# EAGLE design keyring (EAGLE 6.5.0)
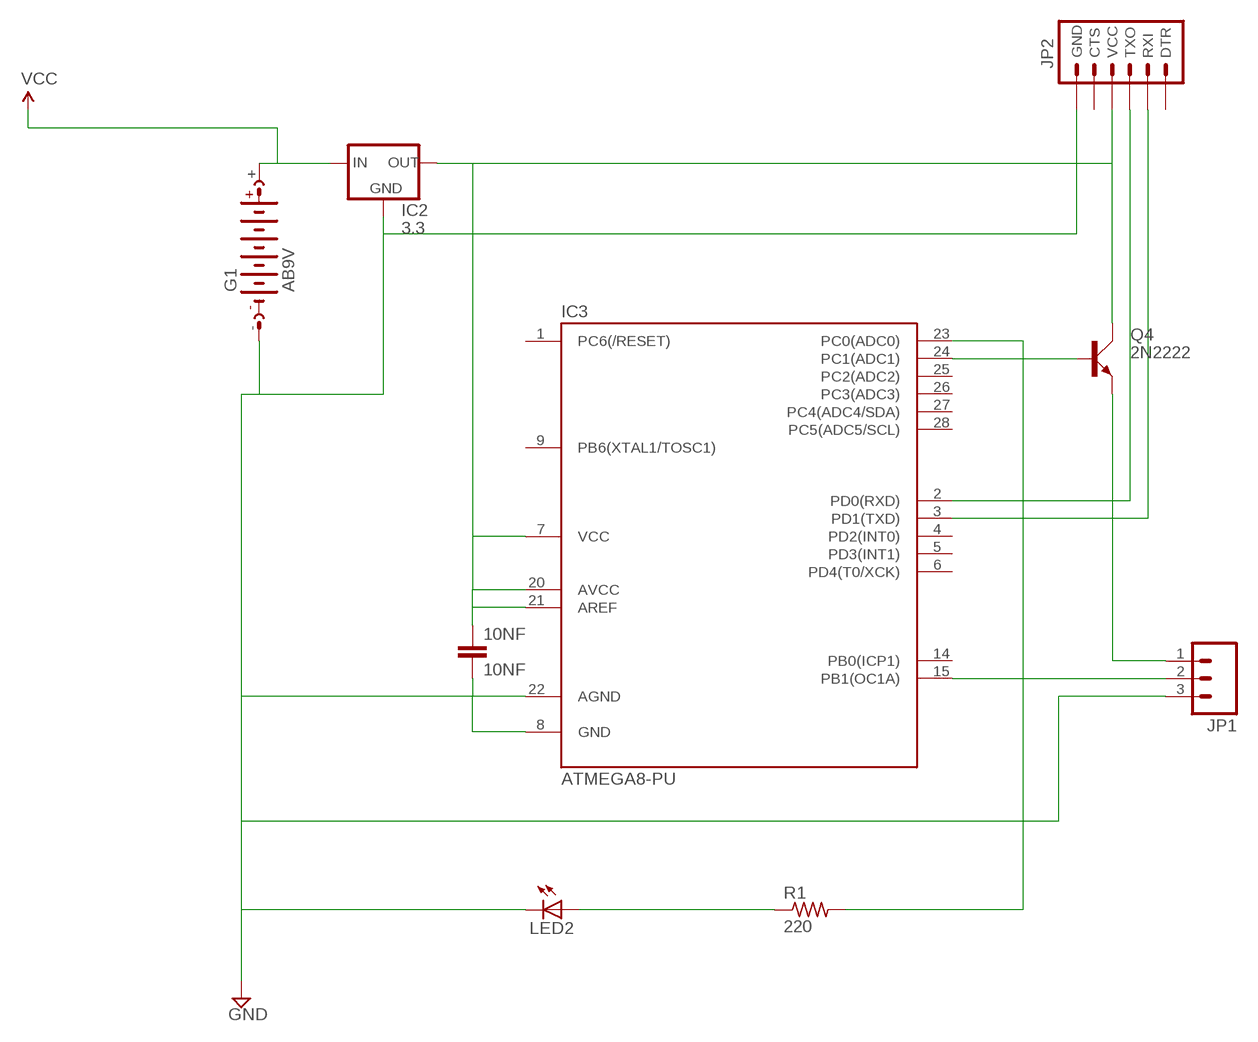
[diagram p0: schematic, sheet 1]

## Parts
10NF  10NF  C2.5/4  [C2.5-4]
G1  AB9V  [AB9V]
IC2  3.3  V_REG_78XXSINK  [TO220-IGO]
IC3  ATMEGA8-PU  [DIL28-3]
JP1  M03LONGPADS  [1X03_LONGPADS]
JP2  ARDUINO_SERIAL_PROGRAMLONGPADS  [1X06_LONGPADS]
LED2  LED3MM  [LED3MM]
Q4  2N2222  [TO18A]
R1  220  R-US_0207/12  [0207/12]

## Nets
N$1: IC3.24(PC1(ADC1)) Q4.B
N$2: IC3.3(PD1(TXD)) JP2.2(RXI)
N$3: IC3.2(PD0(RXD)) JP2.3(TXO)
N$4: JP1.1(OUT) Q4.E
N$5: IC3.23(PC0(ADC0)) R1.2
N$6: IC3.15(PB1(OC1A)) JP1.2(GND)
N$7: LED2.A R1.1
N$8: 10NF.1 IC2.OUT IC3.7(VCC) IC3.20(AVCC) IC3.21(AREF) JP2.4(VCC) Q4.C
N$10: 10NF.2 G1.- IC2.GND IC3.8(GND) IC3.22(AGND) JP1.3(VCC) JP2.6(GND) LED2.K(C) ; supply symbol labelled GND
VCC: G1.+ IC2.IN
Unconnected: IC3.1(PC6(/RESET)) IC3.4(PD2(INT0)) IC3.5(PD3(INT1)) IC3.6(PD4(T0/XCK)) IC3.9(PB6(XTAL1/TOSC1)) IC3.14(PB0(ICP1)) IC3.25(PC2(ADC2)) IC3.26(PC3(ADC3)) IC3.27(PC4(ADC4/SDA)) IC3.28(PC5(ADC5/SCL)) JP2.1(DTR) JP2.5(CTS)

## Library data of the parts
10NF = capacitor-wima:C: CAPACITOR naming: grid - package width
G1 = battery:AB9V: 9-V BATTERY CLIP
IC2 = SparkFun:V_REG_78XX: Voltage Regulator Standard 7805 5V regulator. IGO (Input Ground Output). Spark Fun Electronics SKU : COM-00107
IC3 = atmega8 uden ben:ATMEGA8-PU
JP1 = SparkFun:M03: Header 3 Standard 3-pin 0.1" header. Use with straight break away headers (SKU : PRT-00116), right angle break away headers (PRT-00553), swiss pins (PRT-00743), machine pins (PRT-00117), and female headers (PRT-00115). Molex polarized connector foot print use with SKU : PRT-08232 with associated crimp pins and housings.
JP2 = SparkFun:ARDUINO_SERIAL_PROGRAM
LED2 = led:LED: LED OSRAM: - CHIPLED LG R971, LG N971, LY N971, LG Q971, LY Q971, LO R971, LY R971 LH N974, LH R974 LS Q976, LO Q976, LY Q976 LO Q996 - Hyper CHIPLED LW Q18S LB Q993, LB Q99A, LB R99A - SideLED LS A670, LO A670, LY A670, LG A670, LP A670 LB A673, LV A673, LT A673, LW A673 LH A674 LY A675 LS A676, LA A676, LO A676, LY A676, LW A676 LS A679, LY A679, LG A679 - Hyper Micro SIDELED® LS Y876, LA Y876, LO Y876, LY Y876 LT Y87S - SmartLED LW L88C, LW L88S LB L89C, LB L89S, LG L890 LS L89K, LO L89K, LY L89K LS L896, LA L896, LO L896, LY L896 - TOPLED LS T670, LO T670, LY T670, LG T670, LP T670 LSG T670, LSP T670, LSY T670, LOP T670, LYG T670 LG T671, LOG T671, LSG T671 LB T673, LV T673, LT T673, LW T673 LH T674 LS T676, LA T676, LO T676, LY T676, LB T676, LH T676, LSB T676, LW T676 LB T67C, LV T67C, LT T67C, LS T67K, LO T67K, LY T67K, LW E67C LS E67B, LA E67B, LO E67B, LY E67B, LB E67C, LV E67C, LT E67C LW T67C LS T679, LY T679, LG T679 LS T770, LO T770, LY T770, LG T770, LP T770 LB T773, LV T773, LT T773, LW T773 LH T774 LS E675, LA E675, LY E675, LS T675 LS T776, LA T776, LO T776, LY T776, LB T776 LHGB T686 LT T68C, LB T68C - Hyper Mini TOPLED® LB M676 - Mini TOPLED Santana® LG M470 LS M47K, LO M47K, LY M47K Source: http://www.osram.convergy.de LUXEON: - LUMILED® LXK2-PW12-R00, LXK2-PW12-S00, LXK2-PW14-U00, LXK2-PW14-V00 LXK2-PM12-R00, LXK2-PM12-S00, LXK2-PM14-U00 LXK2-PE12-Q00, LXK2-PE12-R00, LXK2-PE12-S00, LXK2-PE14-T00, LXK2-PE14-U00 LXK2-PB12-K00, LXK2-PB12-L00, LXK2-PB12-M00, LXK2-PB14-N00, LXK2-PB14-P00, LXK2-PB14-Q00 LXK2-PR12-L00, LXK2-PR12-M00, LXK2-PR14-Q00, LXK2-PR14-R00 LXK2-PD12-Q00, LXK2-PD12-R00, LXK2-PD12-S00 LXK2-PH12-R00, LXK2-PH12-S00 LXK2-PL12-P00, LXK2-PL12-Q00, LXK2-PL12-R00 Source: www.luxeon.com KINGBRIGHT: KA-3528ASYC Source: www.kingbright.com
Q4 = transistor-small-signal:2N2222: NPN TRANSISTOR
R1 = resistor:R-US_: RESISTOR, American symbol

## Board
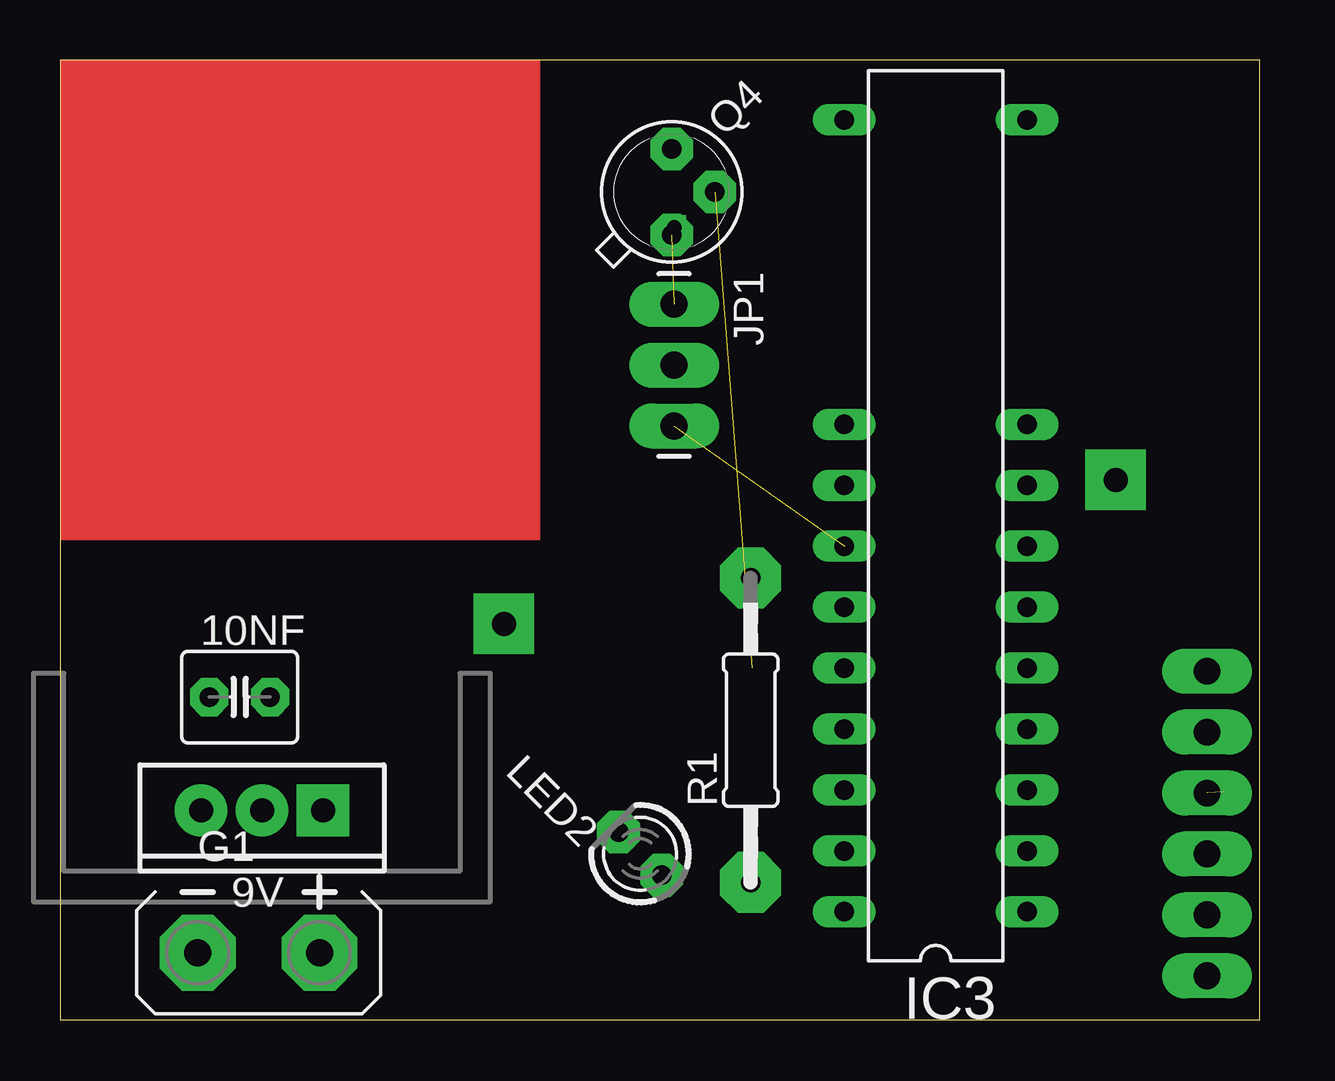
[diagram p1: board, top side]
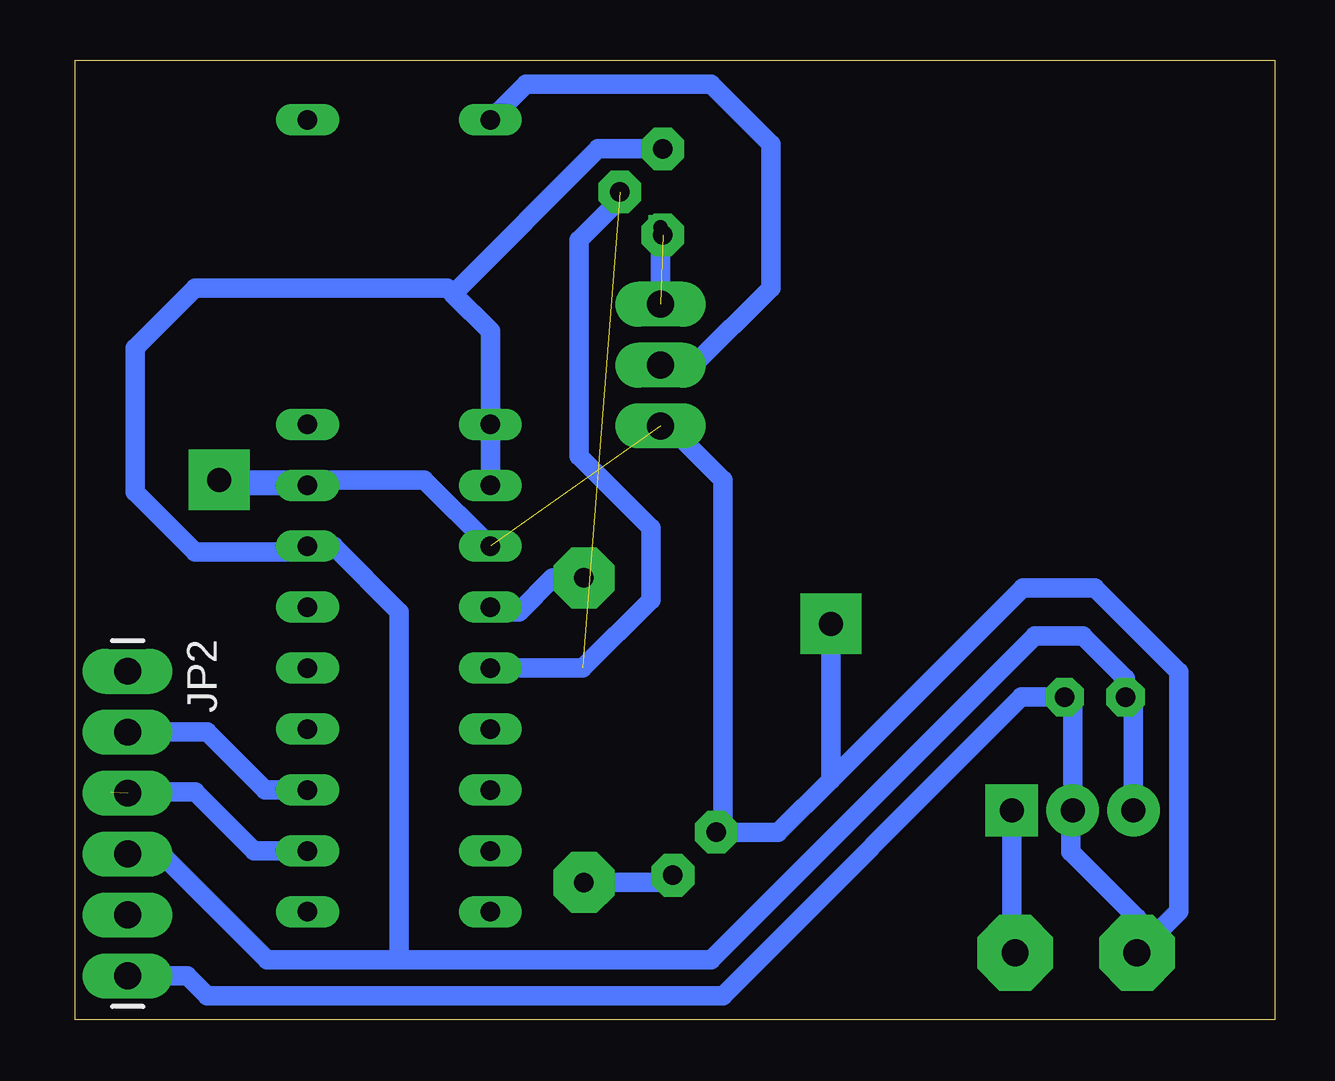
[diagram p2: board, bottom side, seen from below]

Size 50 x 40 mm. Coordinates in mm from the lower left corner, seen from the top.
Outline: 0,0 50,0 50,40 0,40 0,0
Copper layers (1*16): Top 0.035mm / dielectric 1.5mm / Bottom 0.035mm
Design rules "default": minimum track width 10mil, minimum drill 24mil, track to track 8mil, track to pad 8mil, pad to pad 8mil, via to via 8mil, smd to smd 8mil, copper to edge 40mil, drill to drill 8mil, minimum pad ring 10mil, minimum via ring 8mil, stop-mask expansion 4mil, vias tented up to drill 0mil, thermal gap 10mil

### Footprints (pad centres in the part's own frame; a part is rotated, then mirrored left to right if it is on the bottom)
C2.5-4 = drill 0.813 pad 1.6 octagon: 1 -1.27,0; 2 1.27,0
AB9V = drill 1.118 pad 3.15 octagon: + 0,2.54; - 0,-2.54
TO220-IGO = drill 1 pad 2.184: GND 0,0; OUT 2.54,0 | drill 1 pad 2.184 square: IN -2.54,0
DIL28-3 = drill 0.813 long: 1 -16.51,-3.81; 2 -13.97,-3.81; 3 -11.43,-3.81; 4 -8.89,-3.81; 5 -6.35,-3.81; 6 -3.81,-3.81; 7 -1.27,-3.81; 8 1.27,-3.81; 9 3.81,-3.81; 14 16.51,-3.81; 15 16.51,3.81; 20 3.81,3.81; 21 1.27,3.81; 22 -1.27,3.81; 23 -3.81,3.81; 24 -6.35,3.81; 25 -8.89,3.81; 26 -11.43,3.81; 27 -13.97,3.81; 28 -16.51,3.81
1X03_LONGPADS = drill 1.118 pad 1.88 long: 1 0,0; 2 2.54,0; 3 5.08,0
1X06_LONGPADS = drill 1.118 pad 1.88 long: 1 0,0; 2 2.54,0; 3 5.08,0; 4 7.62,0; 5 10.16,0; 6 12.7,0
LED3MM = drill 0.813 pad 1.778 octagon: A -1.27,0; K 1.27,0
TO18A = drill 0.813 pad 1.778 octagon: B 1.27,-1.27; C 1.27,1.27; E -1.27,-1.27
0207/12 = drill 0.813 pad 2.54 octagon: 1 -6.35,0; 2 6.35,0

### Placement (x,y rotation side)
10NF  7.49,13.44 0 top
G1  8.28,2.78 270 top
IC2  8.42,8.72 180 top
IC3  36.5,21 90 top
JP1  25.6,29.82 270 top
JP2  47.81,14.52 270 bottom
LED2  24.18,6.91 135 top
Q4  25.5,34.5 45 top
R1  28.79,12.06 90 top

### Tracks (layer width: path | path; a pad name or v marks a point on that pad's centre or on a via)
N$1  (1 unrouted)
  Bottom 0.813: 27.36,34.14 29,32.5 29,23.5 26,20.5 26,17.5 28.85,14.65 IC3.24
N$2
  Bottom 0.813: IC3.3 42.07,9.57 44.5,12 47.79,12 JP2.2
N$3  (1 unrouted)
  Bottom 0.813: IC3.2 42.53,7.03 45,9.5 48.5,9.5
N$4  (via drill 0.6)  (1 unrouted)
  Bottom 0.813: JP1.1 v25.6,33.02
N$5
  Bottom 0.813: R1.2 30.09,18.41 31.5,17 32.5,17 IC3.23
N$6
  Bottom 0.813: JP1.2 24.22,27.28 21,30.5 21,36.5 23.5,39 31.2,39 IC3.15
N$7
  Bottom 0.813: R1.1 25.38,5.71 LED2.A
N$8
  Bottom 0.813: 36.5,2.5 42,2.5 46.5,7 47.71,7 JP2.4 | 36.5,2.5 23.5,2.5 10,16 8,16 6.22,14.22 6.22,14 | 10NF.1 6.22,14 | IC2.OUT 5.88,13.66 6.22,14 | 36.5,2.5 36.5,17 39.23,19.73 IC3.7 40.54,19.5 45,19.5 47.5,22 47.5,28 45,30.5 34.5,30.5 34.25,30.25 | IC3.20 IC3.21 32.69,28.69 34.25,30.25 | Q4.C 28.2,36.3 34.25,30.25
N$10  (via drill 1 pad 2.54)  (1 unrouted)
  Bottom 0.813: JP2.6 45.32,1.82 44.5,1 23,1 10.56,13.44 10NF.2 8.42,13.1 IC2.GND 8.5,8.64 8.5,7 5.74,4.24 G1.- 4,4.52 4,14.5 7.5,18 10.5,18 18.5,10 | 18.5,10 20.69,7.81 LED2.K 23,8.09 23,22.5 25.24,24.74 JP1.3 | IC3.8 43.77,22.27 44,22.5 35.46,22.5 IC3.22 | v18.5,16.5 18.5,10
N$11  (via drill 1 pad 2.54)
  other vias: 44,22.5
VCC
  Bottom 0.813: IC2.IN 10.96,2.92 G1.+
(copper drawn outside any net)
  shapes: Top area x1